# EAGLE schematic pcb project (EAGLE 9.6.2)
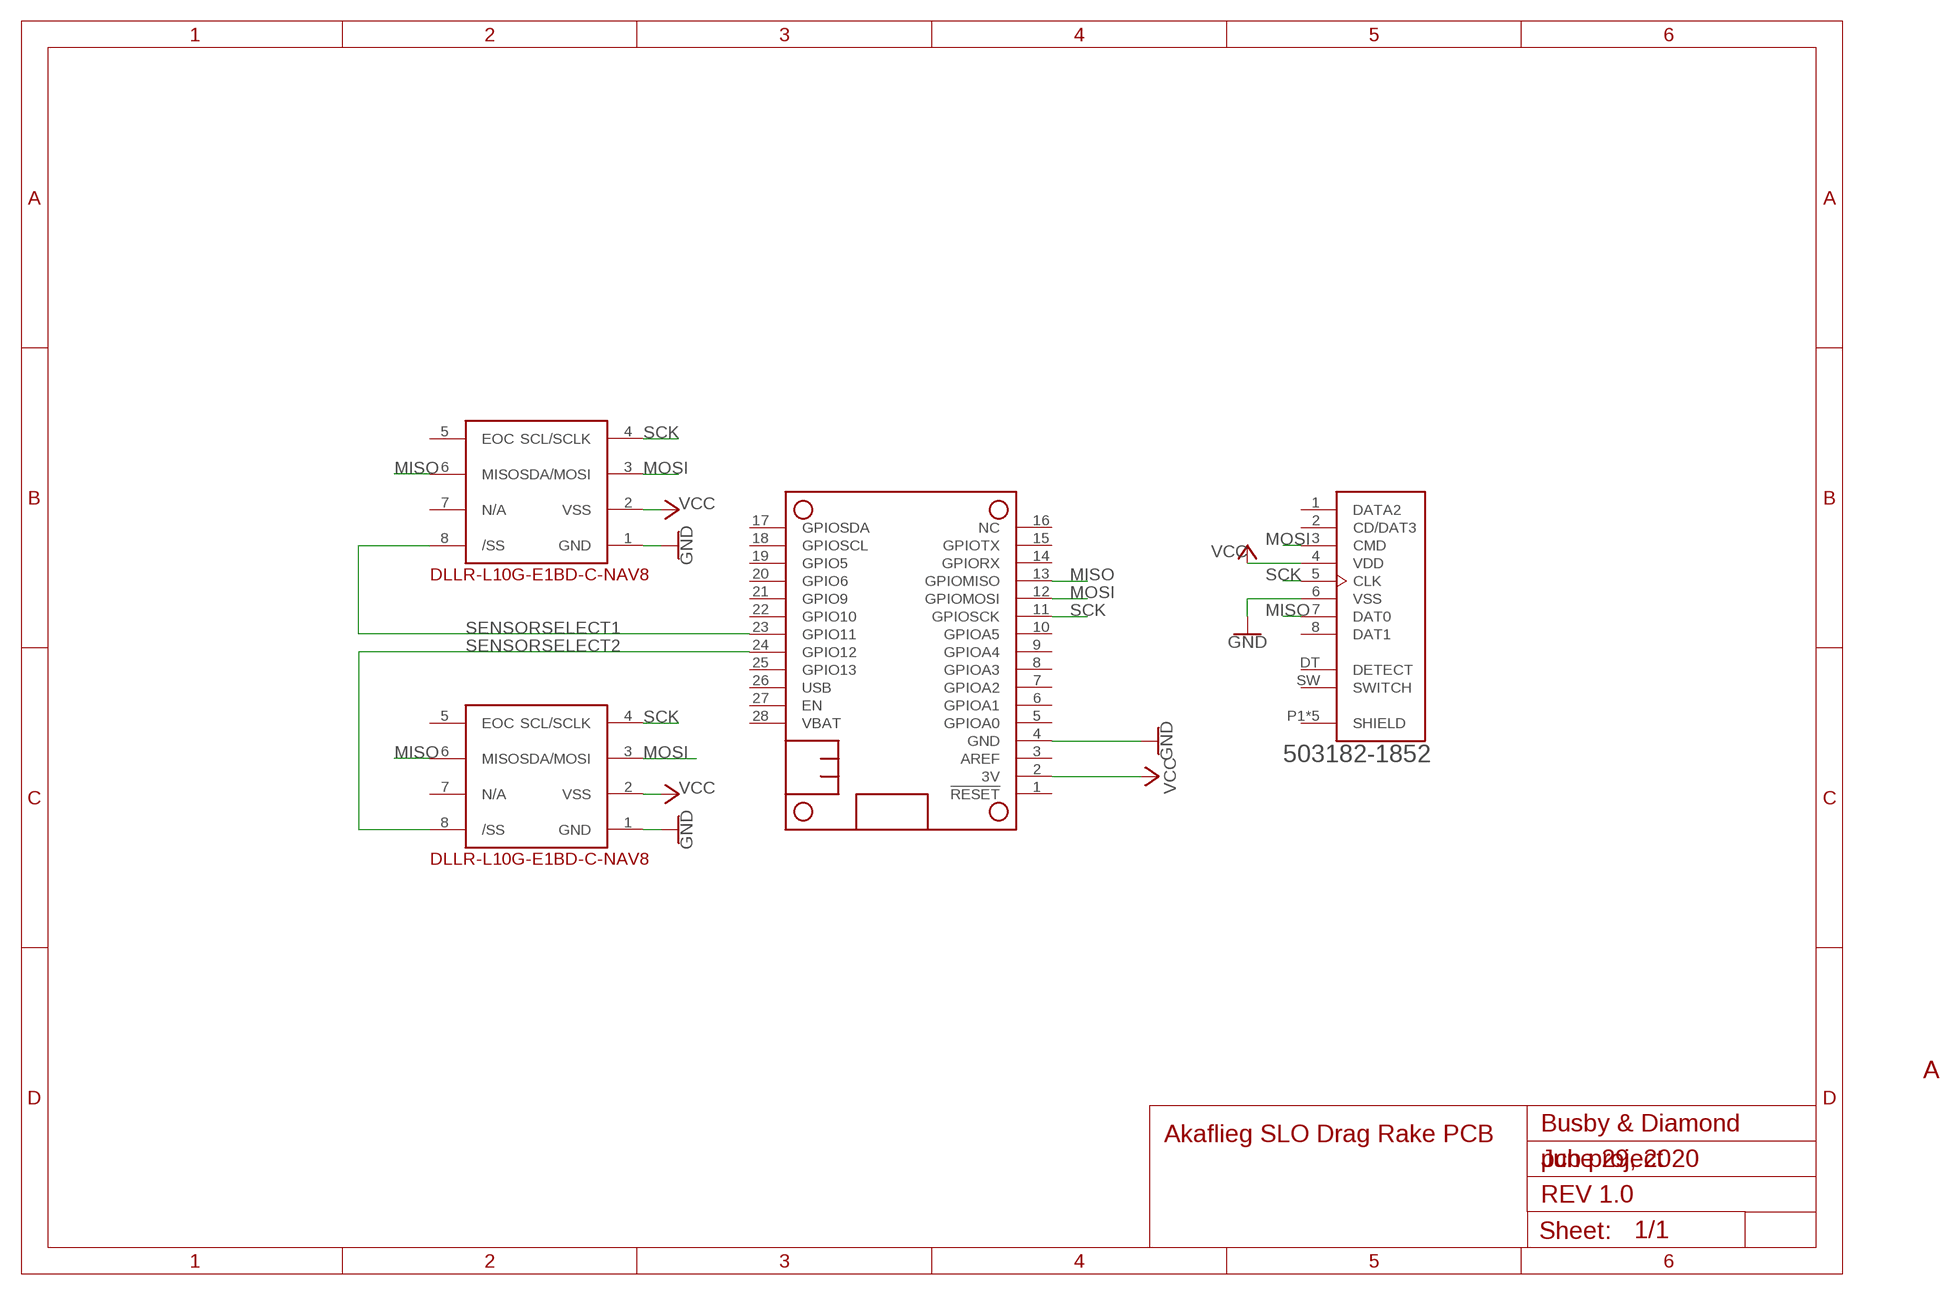
[diagram p0: schematic, sheet 1]

## Parts
DLLR-L10G-E1BD-C-NAV8_BOT  DLLR-L10G-E1BD-C-NAV8_BOT  DLLR-L10G-E1BD-C-NAV8DLLR-L10G-E1BD-C-NAV8  [DLLR-L10G-E1BD-C-NAV8]
DLLR-L10G-E1BD-C-NAV8_TOP  DLLR-L10G-E1BD-C-NAV8_TOP  DLLR-L10G-E1BD-C-NAV8DLLR-L10G-E1BD-C-NAV8  [DLLR-L10G-E1BD-C-NAV8]
MS1  FEATHERWING  [FEATHERWING]
SD_CARD  503182-1852  [MOLEX_503182-1852]

## Nets
GND: DLLR-L10G-E1BD-C-NAV8_BOT.1(GND) DLLR-L10G-E1BD-C-NAV8_TOP.1(GND) MS1.4(GND) SD_CARD.6(VSS)
MISO: DLLR-L10G-E1BD-C-NAV8_BOT.6(MISO) DLLR-L10G-E1BD-C-NAV8_TOP.6(MISO) MS1.13(GPIOMISO) SD_CARD.7(DAT0)
MOSI: DLLR-L10G-E1BD-C-NAV8_BOT.3(SDA/MOSI) DLLR-L10G-E1BD-C-NAV8_TOP.3(SDA/MOSI) MS1.12(GPIOMOSI) SD_CARD.3(CMD)
SCK: DLLR-L10G-E1BD-C-NAV8_BOT.4(SCL/SCLK) DLLR-L10G-E1BD-C-NAV8_TOP.4(SCL/SCLK) MS1.11(GPIOSCK) SD_CARD.5(CLK)
SENSORSELECT1: DLLR-L10G-E1BD-C-NAV8_TOP.8(/SS) MS1.23(GPIO11)
SENSORSELECT2: DLLR-L10G-E1BD-C-NAV8_BOT.8(/SS) MS1.24(GPIO12)
VCC: DLLR-L10G-E1BD-C-NAV8_BOT.2(VSS) DLLR-L10G-E1BD-C-NAV8_TOP.2(VSS) MS1.2(3V) SD_CARD.4(VDD)
Unconnected: DLLR-L10G-E1BD-C-NAV8_BOT.5(EOC) DLLR-L10G-E1BD-C-NAV8_BOT.7(N/A) DLLR-L10G-E1BD-C-NAV8_TOP.5(EOC) DLLR-L10G-E1BD-C-NAV8_TOP.7(N/A) MS1.1(!RESET) MS1.3(AREF) MS1.5(GPIOA0) MS1.6(GPIOA1) MS1.7(GPIOA2) MS1.8(GPIOA3) MS1.9(GPIOA4) MS1.10(GPIOA5) MS1.14(GPIORX) MS1.15(GPIOTX) MS1.16(NC) MS1.17(GPIOSDA) MS1.18(GPIOSCL) MS1.19(GPIO5) MS1.20(GPIO6) MS1.21(GPIO9) MS1.22(GPIO10) MS1.25(GPIO13) MS1.26(USB) MS1.27(EN) MS1.28(VBAT) SD_CARD.1(DATA2) SD_CARD.2(CD/DAT3) SD_CARD.8(DAT1) SD_CARD.DT(DETECT) SD_CARD.P1(SHIELD) SD_CARD.P2(SHIELD) SD_CARD.P3(SHIELD) SD_CARD.P4(SHIELD) SD_CARD.P5(SHIELD) SD_CARD.SW(SWITCH)

## Notes on the sheet
- A
- Busby & Diamond
- Akaflieg SLO Drag Rake PCB
- June 29, 2020
- REV 1.0

## Library data of the parts
DLLR-L10G-E1BD-C-NAV8_BOT DLLR-L10G-E1BD-C-NAV8_TOP = DLLR_L10G_E1BD_C_NAV8:DLLR-L10G-E1BD-C-NAV8: DLLR-L10G-E1BD-C-NAV8 From Amphenol Sensors
MS1 = superioradafruit:FEATHERWING
SD_CARD = 503182-1852:503182-1852: Conn Micro SD Card M 8 POS 1.09mm Solder RA SMD Embossed T/R 0.5A/Contact; DESCRIPTION: 10 _8 + 2_ Position Card Connector microSD™ Surface Mount, Right Angle Gold; DIGI-KEY_PART_NUMBER: WM12834CT-ND; DIGI-KEY_PURCHASE_URL: https://www.digikey.com/product-detail/en/molex/5031821852/WM12834CT-ND/5823232?utm_source=snapeda&utm_medium=aggregator&utm_campaign=symbol; MF: Molex; MP: 5031821852; PACKAGE: None

## Net classes
0 default: width 0.127 mm, drill 0.254 mm, clearance 0.127 mm